# EAGLE schematic cpuConnectionBoard (EAGLE 7.2.0)
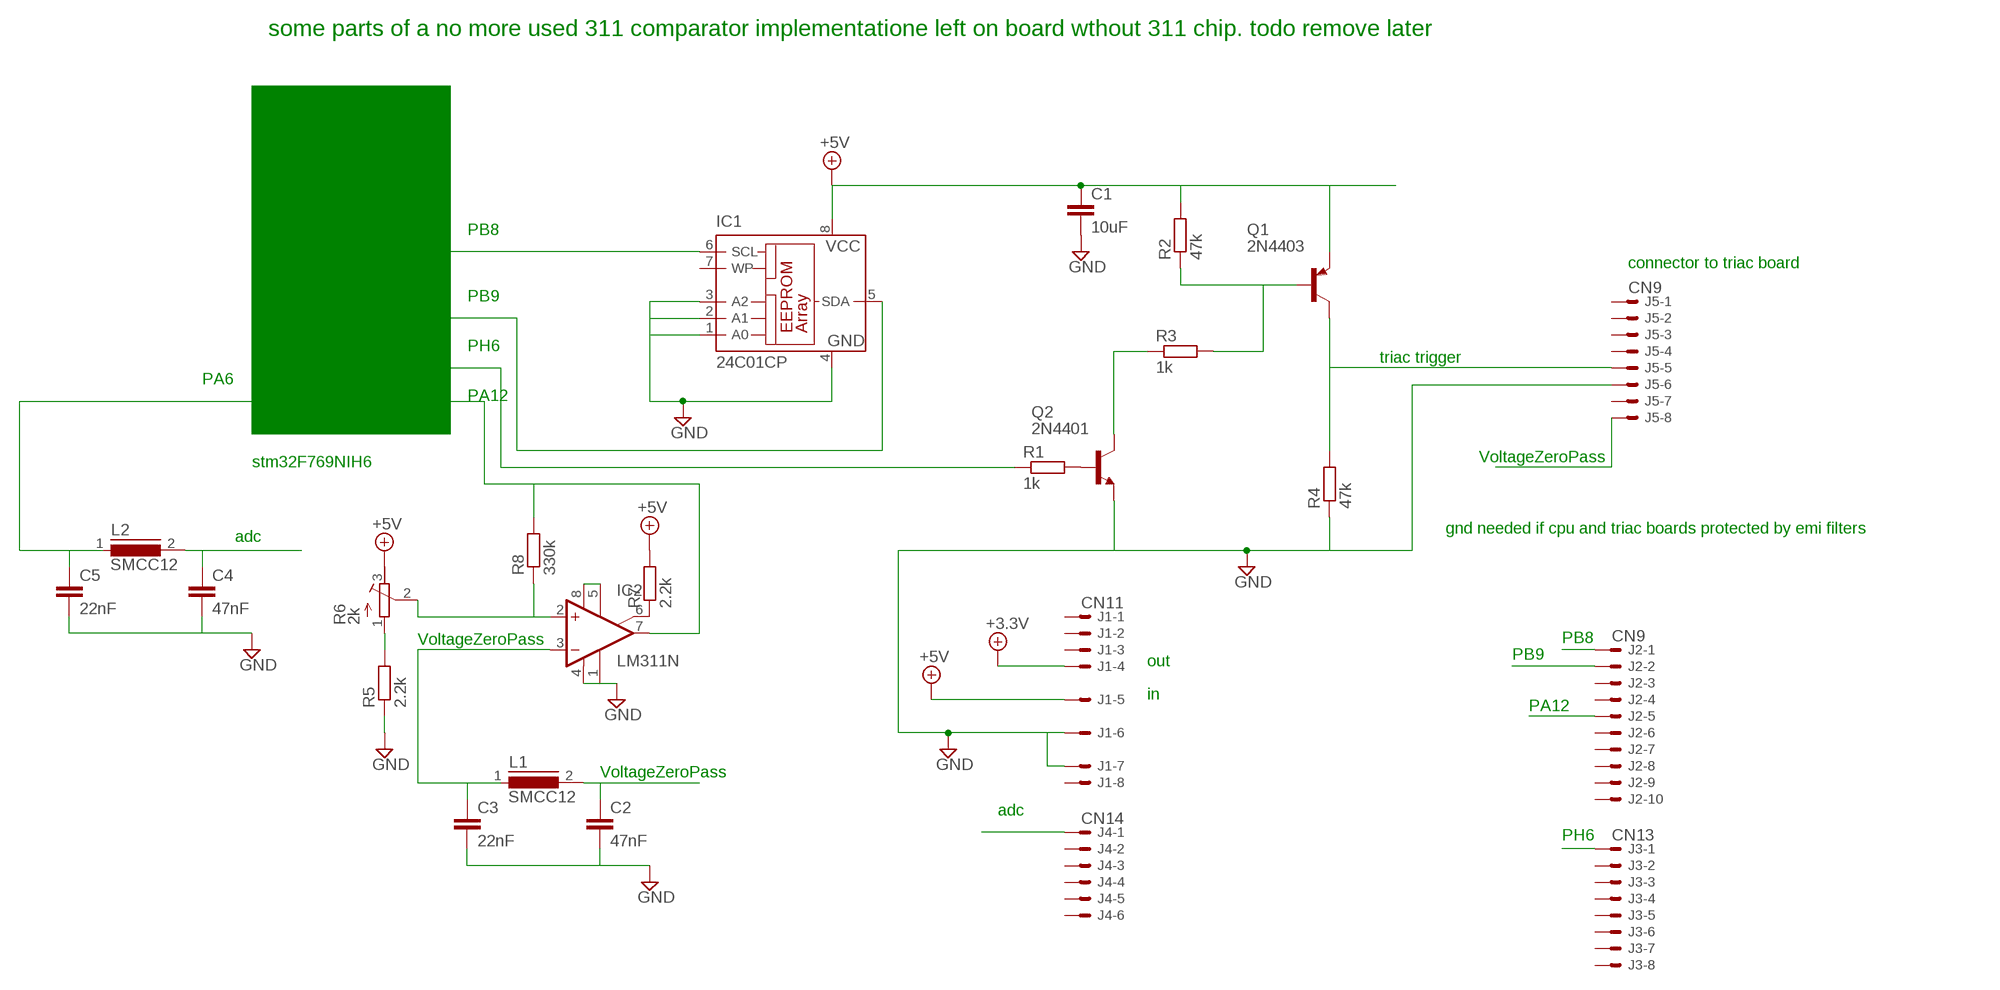
[diagram p0: schematic, sheet 1]

## Parts
C1  10uF  C-EU050-030X075  [C050-030X075]
C2  47nF  C-EU050-030X075  [C050-030X075]
C3  22nF  C-EU050-030X075  [C050-030X075]
C4  47nF  C-EU050-030X075  [C050-030X075]
C5  22nF  C-EU050-030X075  [C050-030X075]
IC1  24C01CP  [DIL8]
IC2  LM311N  [DIL08]
J1  CN11  XF2E-0815-1  [XF2E-0815-1]
J2  CN9  XF2E-1015-1  [XF2E-1015-1]
J3  CN13  XF2E-0815-1  [XF2E-0815-1]
J4  CN14  XF2E-0815-1  [XF2E-0815-1]
J5  CN9  XF2E-1015-1  [XF2E-1015-1]
L1  SMCC12  [SMCC12]
L2  SMCC12  [SMCC12]
Q1  2N4403  2N4902  [TO3]
Q2  2N4401  2N4416  [TO92]
R1  1k  R-EU_0309/12  [0309/12]
R2  47k  R-EU_0309/12  [0309/12]
R3  1k  R-EU_0309/12  [0309/12]
R4  47k  R-EU_0309/12  [0309/12]
R5  2.2k  R-EU_0309/12  [0309/12]
R6  2k  R-TRIMM64P  [RTRIM64P]
R7  2.2k  R-EU_0309/12  [0309/12]
R8  330k  R-EU_0309/12  [0309/12]

## Nets
+5V: C1.1 IC1.8(VCC) J1.4 J1.5 Q1.E R2.2 R6.3(E) R7.2 ; supply symbol labelled +3.3V
GND: C1.2 C2.2 C3.2 C4.2 C5.2 IC1.1(A0) IC1.2(A1) IC1.3(A2) IC1.4(GND) IC2.4(V-) J1.6 J1.7 J5.6 Q2.3(E) R4.1 R5.1
N$1: IC1.5(SDA)
N$2: IC1.6(SCL)
N$3: Q1.B R2.1 R3.2
N$4: Q2.2(B) R1.2
N$5: Q2.1(C) R3.1
N$6: R1.1
N$7: IC2.7(OUT) R8.2
N$8: J5.5 Q1.C Q1.C/(C) R4.2
N$9: J5.8
N$10: C3.1 IC2.3(-IN)
N$11: R5.2 R6.1(A)
N$12: IC2.2(+IN) R6.2(S) R8.1
N$13: J2.5
N$14: J2.1
N$15: J2.2
N$16: IC2.5(ON) IC2.8(V+)
N$17: IC2.6(ON/STR) R7.1
N$18: J3.1
N$19: J4.1
N$20: C2.1 L1.2
N$34: C4.1 L2.2
N$35: C5.1 L2.1
Unconnected: IC1.7(WP) IC2.1(GND) J1.1 J1.2 J1.3 J1.8 J2.3 J2.4 J2.6 J2.7 J2.8 J2.9 J2.10 J3.2 J3.3 J3.4 J3.5 J3.6 J3.7 J3.8 J4.2 J4.3 J4.4 J4.5 J4.6 J4.7 J4.8 J5.1 J5.2 J5.3 J5.4 J5.7 J5.9 J5.10 L1.1

## Notes on the sheet
- some parts of a no more used 311 comparator implementatione left on board wthout 311 chip. todo remove later
- PB8
- connector to triac board
- PB9
- PH6
- triac trigger
- PA6
- PA12
- VoltageZeroPass
- stm32F769NIH6
- gnd needed if cpu and triac boards protected by emi filters
- adc
- VoltageZeroPass | PB8
- PB9
- out
- in
- PA12
- VoltageZeroPass
- adc
- PH6

## Library data of the parts
C1-C5 = resistor:C-EU: CAPACITOR, European symbol
IC1 = microchip:24C*: Serial EEPROM 1 K/2 K/4 K; MF: MICROCHIP; MPN: 24C01C/P; OC_FARNELL: 3662901; OC_NEWARK: 96K4060
IC2 = linear:LM311: COMPARATOR
J1 J3 J4 = con-omron:XF2*-08?: OMRON FPC Connector Source : http://www.omron.com/ecb/products/pdf/fpc.pdf; MPN: XF2E-0815-1; OC_FARNELL: unknown; OC_NEWARK: 37M9451
J2 J5 = con-omron:XF2*-10?: OMRON FPC Connector Source : http://www.omron.com/ecb/products/pdf/fpc.pdf; MPN: XF2E-1015-1; OC_FARNELL: unknown; OC_NEWARK: 37M0755
L1 L2 = inductors:SMCC12: INDUCTOR
Q1 = transistor-pnp:2N4902: PNP Transistor
Q2 = transistor-npn:2N4416: NPN Transistor
R1-R5 R7 R8 = resistor:R-EU_: RESISTOR, European symbol
R6 = resistor:R-TRIMM: Trimm resistor